# EAGLE schematic PANDASchematic (EAGLE 7.1.0)
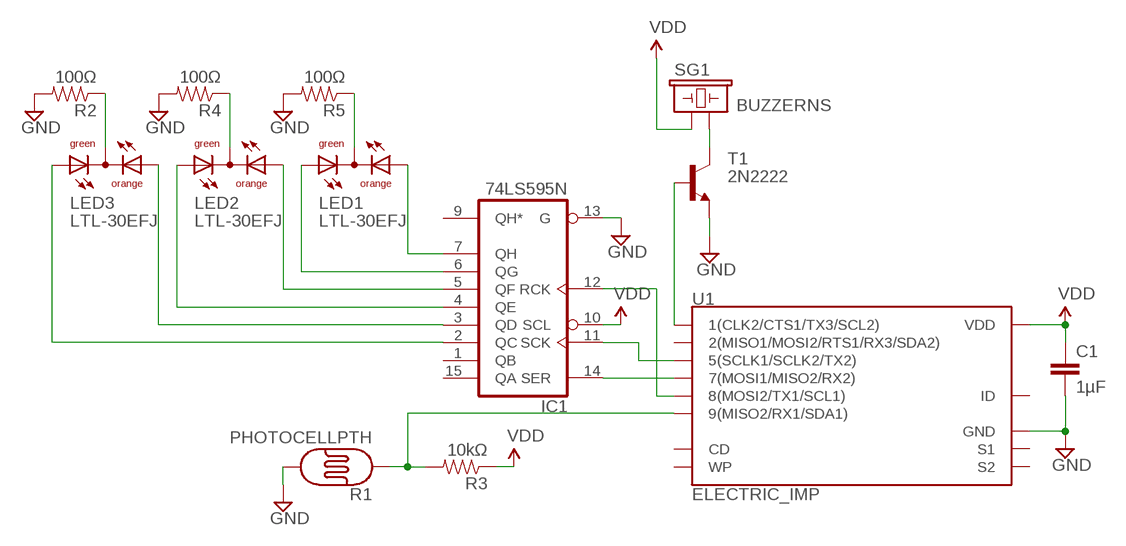
[diagram p0: schematic, sheet 1]

## Parts
C1  1µF  CAPPTH  [CAP-PTH-SMALL]
IC1  74LS595N  [DIL16]
LED1  LTL-30EFJ  TLUV5300  [TLUV5300]
LED2  LTL-30EFJ  TLUV5300  [TLUV5300]
LED3  LTL-30EFJ  TLUV5300  [TLUV5300]
R1  PHOTOCELLPTH  [PHOTOCELL]
R2  100Ω  RESISTORAXIAL-0.3  [AXIAL-0.3]
R3  10kΩ  RESISTORAXIAL-0.3  [AXIAL-0.3]
R4  100Ω  RESISTORAXIAL-0.3  [AXIAL-0.3]
R5  100Ω  RESISTORAXIAL-0.3  [AXIAL-0.3]
SG1  BUZZERNS  [BUZZER-12MM-NS]
T1  2N2222  [TO92-EBC-OVAL]
U1  ELECTRIC_IMP  [SD_1:1]

## Nets
GND: C1.2 IC1.13(G) R1.2 R2.P$2 R4.P$2 R5.P$2 T1.E U1.3(GND)
N$1: IC1.14(SER) U1.7(7(MOSI1/MISO2/RX2))
N$2: IC1.11(SCK) U1.5(5(SCLK1/SCLK2/TX2))
N$3: SG1.- T1.C
N$4: IC1.3(QD) LED3.AO
N$5: IC1.12(RCK) U1.8(8(MOSI2/TX1/SCL1))
N$6: R1.1 R3.P$2 U1.9(9(MISO2/RX1/SDA1))
N$7: IC1.2(QC) LED3.AG
N$8: LED3.CC R2.P$1
N$9: IC1.7(QH) LED1.AO
N$10: IC1.6(QG) LED1.AG
N$11: IC1.5(QF) LED2.AO
N$12: IC1.4(QE) LED2.AG
N$13: T1.B U1.1(1(CLK2/CTS1/TX3/SCL2))
N$14: LED2.CC R4.P$1
N$15: LED1.CC R5.P$1
VDD: C1.1 IC1.10(SCL) R3.P$1 SG1.+ U1.4(VDD)
Unconnected: IC1.1(QB) IC1.9(QH*) IC1.15(QA) U1.2(2(MISO1/MOSI2/RTS1/RX3/SDA2)) U1.6(ID) U1.CD U1.SH@1(S1) U1.SH@2(S2) U1.WP

## Power pins joined to a net without a drawn wire
GND: IC1.8(GND)
VCC: IC1.16(VCC)

## Library data of the parts
C1 = SparkFun-Capacitors:CAP: Capacitor Standard 0603 ceramic capacitor, and 0.1" leaded capacitor.
IC1 = 74xx-us:74*595: 8-bit SHIFT REGISTER, output latch
LED1-LED3 = led:TLUV5300: Bicolor LED 5 mm Untinted Diffused Package Source: www.vishay.com .. Bi-Color LED Vashay TLUV5300.pdf
R1 = SparkFun-Sensors:PHOTOCELL: CdS photoresistor. This is a low cost way to detect light levels. Resistance decreases with more incoming light. SparkFun SKU: SEN-09088
R2-R5 = SparkFun-Passives:RESISTOR: Resistor Basic schematic elements and footprints for 0603, 1206, and PTH resistors.
SG1 = SparkFun-Electromechanical:BUZZER: Buzzer 12mm Spark Fun Electronics SKU : Comp-Buzzer
T1 = adafruit:2N2222: NPN TRANSISTOR Big oval pads
U1 = SparkFun-RF:ELECTRIC_IMP: Electric Imp SD Socket This symbol matches the Electric Imp <https://www.sparkfun.com/products/11395> pinout to a 4UCONN SD MMC connector. The 4UCONN part number is 19646 <http://www.4uconnector.com/online/Itemadrawing.asp?fldseries=19646&seriesno_a=12>. See this part in action on the Electric Imp Breakout <https://www.sparkfun.com/products/11400>.; PROD_ID: CONN-11976